# EAGLE schematic Board (EAGLE 9.4.2)
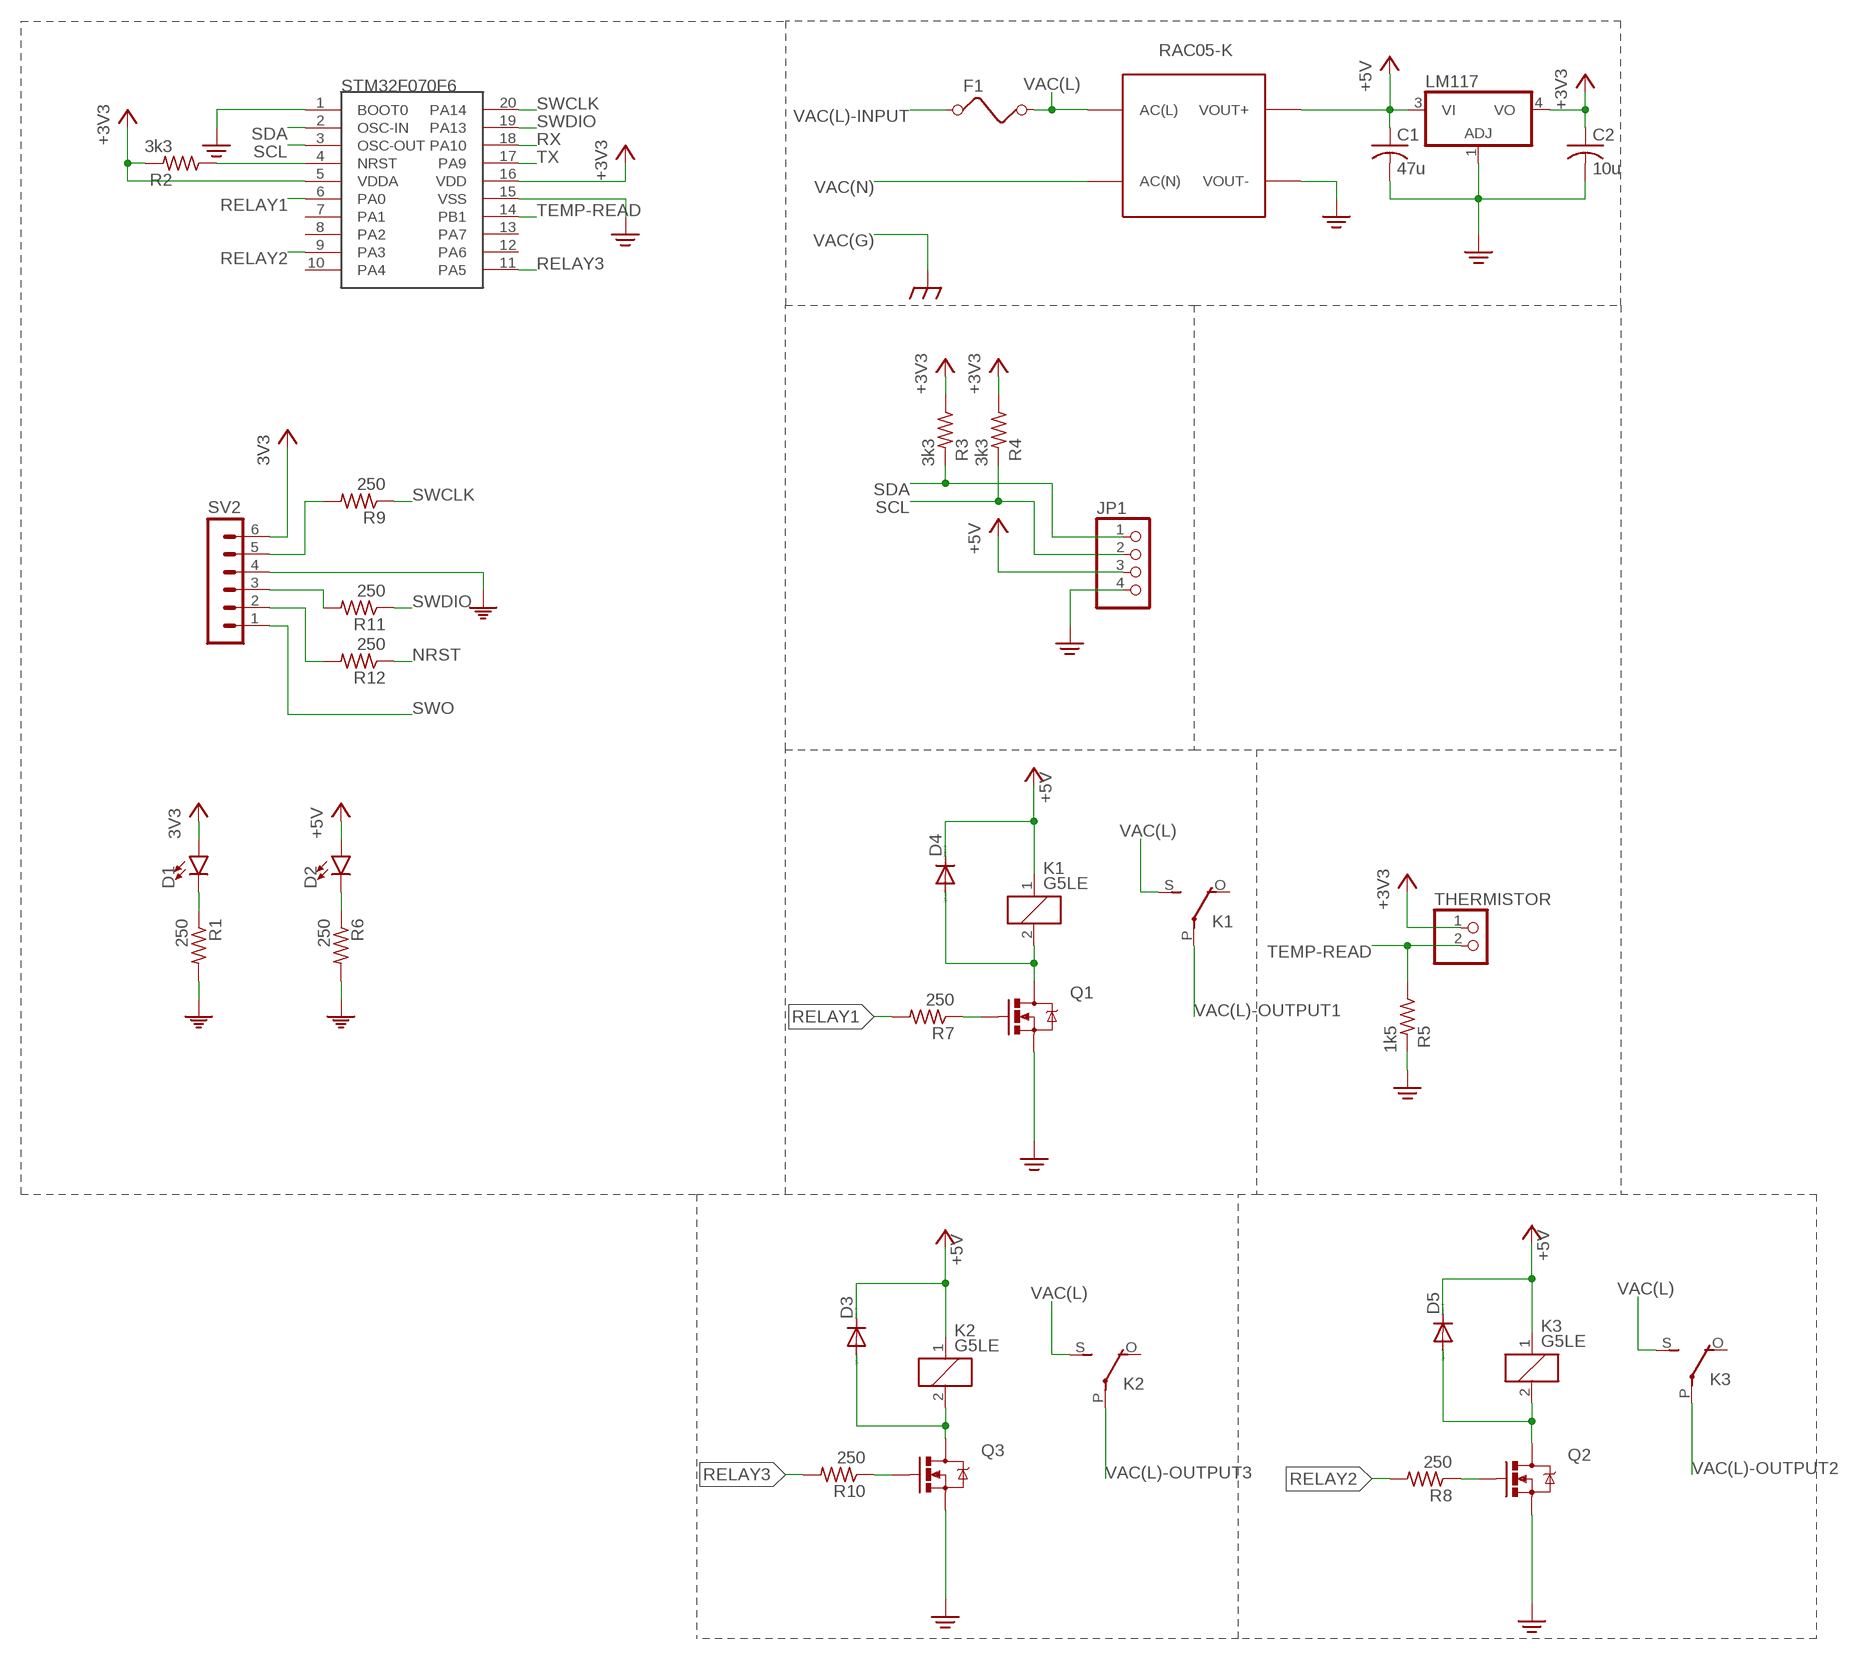
[diagram p0: schematic, sheet 1]

## Parts
C1  47u  C-USC0603  [C0603]
C2  10u  C-USC0603  [C0603]
D1  LED0603  [LED-0603]
D2  LED0603  [LED-0603]
D3  1N4004  [DO41-10]
D4  1N4004  [DO41-10]
D5  1N4004  [DO41-10]
F1  FUSE  [FUSE]
JP1  PINHD-1X4  [1X04]
K1  G5LE  [G5LE]
K2  G5LE  [G5LE]
K3  G5LE  [G5LE]
LM117  317EMP  [SOT223]
Q1  MOSFET-NCHANNELSMD  [SOT23-3]
Q2  MOSFET-NCHANNELSMD  [SOT23-3]
Q3  MOSFET-NCHANNELSMD  [SOT23-3]
R1  250  R-US_R0603  [R0603]
R2  3k3  R-US_R0603  [R0603]
R3  3k3  R-US_R0603  [R0603]
R4  3k3  R-US_R0603  [R0603]
R5  1k5  R-US_R0603  [R0603]
R6  250  R-US_R0603  [R0603]
R7  250  R-US_R0603  [R0603]
R8  250  R-US_R0603  [R0603]
R9  250  R-US_R0603  [R0603]
R10  250  R-US_R0603  [R0603]
R11  250  R-US_R0603  [R0603]
R12  250  R-US_R0603  [R0603]
RAC05-K  AC/DC-CONVERTER  [AC/DC-CONVERTER]
STM32F070F6  STM32F07  [TSSOP20]
SV2  MA06-1  [MA06-1]
THERMISTOR  PINHD-1X2  [1X02]

## Nets
+3V3: C2.1 D1.A LM117.4(VO) R2.2 R3.1 R4.1 STM32F070F6.5(VDDA) STM32F070F6.16(VDD) SV2.6 THERMISTOR.1 ; supply symbol labelled 3V3
+5V: C1.1 D2.A D3.C D4.C D5.C JP1.3 K1.1 K2.1 K3.1 LM117.3(VI) RAC05-K.+5V(VOUT+)
FET1: Q1.1(G) R7.1
FET2: Q2.1(G) R8.1
FET3: Q3.1(G) R10.1
GND: C1.2 C2.2 JP1.4 LM117.1(ADJ) R1.2 R5.2 R6.2 RAC05-K.GND(VOUT-) STM32F070F6.1(BOOT0) STM32F070F6.15(VSS) SV2.4 ; supply symbol labelled PE
N$1: D1.C R1.1
N$2: D2.C R6.1
N$3: D4.A K1.2 Q1.3(D)
N$4: D3.A K2.2 Q3.3(D)
N$6: D5.A K3.2 Q2.3(D)
N$19: R9.2 SV2.5
N$21: R11.2 SV2.3
N$22: R12.2 SV2.2
NRST: R2.1 R12.1 STM32F070F6.4(NRST)
PE: Q1.2(S) Q2.2(S) Q3.2(S)
RELAY1: R7.2 STM32F070F6.6(PA0)
RELAY2: R8.2 STM32F070F6.9(PA3)
RELAY3: R10.2 STM32F070F6.11(PA5)
RX: STM32F070F6.18(PA10)
SCL: JP1.2 R4.2 STM32F070F6.3(OSC-OUT)
SDA: JP1.1 R3.2 STM32F070F6.2(OSC-IN)
SWCLK: R9.1 STM32F070F6.20(PA14)
SWDIO: R11.1 STM32F070F6.19(PA13)
SWO: SV2.1
TEMP-READ: R5.1 STM32F070F6.14(PB1) THERMISTOR.2
TX: STM32F070F6.17(PA9)
VAC(L): F1.2 K1.S(2:S) K2.S(2:S) K3.S(2:S) RAC05-K.L(AC(L))
VAC(L)-INPUT: F1.1
VAC(L)-OUTPUT1: K1.P(2:P)
VAC(L)-OUTPUT2: K3.P(2:P)
VAC(L)-OUTPUT3: K2.P(2:P)
VAC(N): RAC05-K.N(AC(N))
Unconnected: K1.O(2:O) K2.O(2:O) K3.O(2:O) STM32F070F6.7(PA1) STM32F070F6.8(PA2) STM32F070F6.10(PA4) STM32F070F6.12(PA6) STM32F070F6.13(PA7)

## Library data of the parts
C1 C2 = rcl:C-US: CAPACITOR, American symbol; SPICEPREFIX: C
D1 D2 = SparkFun-LED:LED: LED (Generic) Standard schematic elements and footprints for 5mm, 3mm, 1206, and 0603 sized LEDs. Generic LEDs with no color specified.
D3-D5 = diode:1N4004: DIODE general purpose rectifier, 1 A
F1 = special:FUSE: FUSE 5 x 20 mm
JP1 = pinhead:PINHD-1X4: PIN HEADER
K1-K3 = relay:G5LE: RELAY 1 x switch, 10 A/120 V AC, 8 A/30 V DC, Omron; OC_FARNELL: unknown; OC_NEWARK: unknown
LM117 = linear:*317: Positive VOLTAGE REGULATOR
Q1-Q3 = fets:MOSFET-NCHANNEL: Generic NMOS footprint
R1-R12 = rcl:R-US_: RESISTOR, American symbol; SPICEPREFIX: R
RAC05-K = SousVide Library:AC/DC-CONVERTER
STM32F070F6 = SousVide Library:STM32F07
SV2 = con-lstb:MA06-1: PIN HEADER; OC_FARNELL: unknown; OC_NEWARK: unknown
THERMISTOR = pinhead:PINHD-1X2: PIN HEADER

## Net classes
0 default: width 0.254 mm, drill 0.254 mm, clearance 0.762 mm